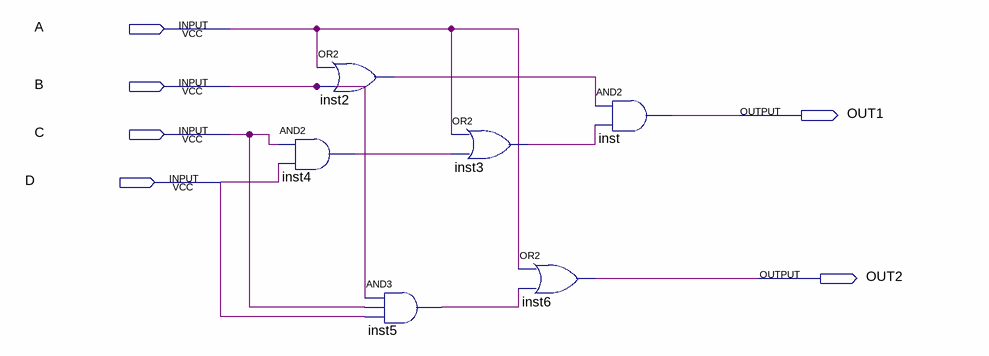
[diagram p0: schematic sheet]
// Quartus schematic practice1.bdf as structural Verilog: 6 symbols, 6 pins
module practice1 (
  input  A,
  input  B,
  input  C,
  input  D,
  output OUT1,
  output OUT2
);

  wire inst2_out, inst3_out, inst4_out, inst5_out;

  and inst4 (inst4_out, C, D);
  or inst2 (inst2_out, A, B);
  and inst5 (inst5_out, B, C, D);
  or inst3 (inst3_out, A, inst4_out);
  or inst6 (OUT2, A, inst5_out);
  and inst (OUT1, inst2_out, inst3_out);
endmodule
